# Altium schematic sheet IOT_ESP32-OUTLET.SchDoc
size A2
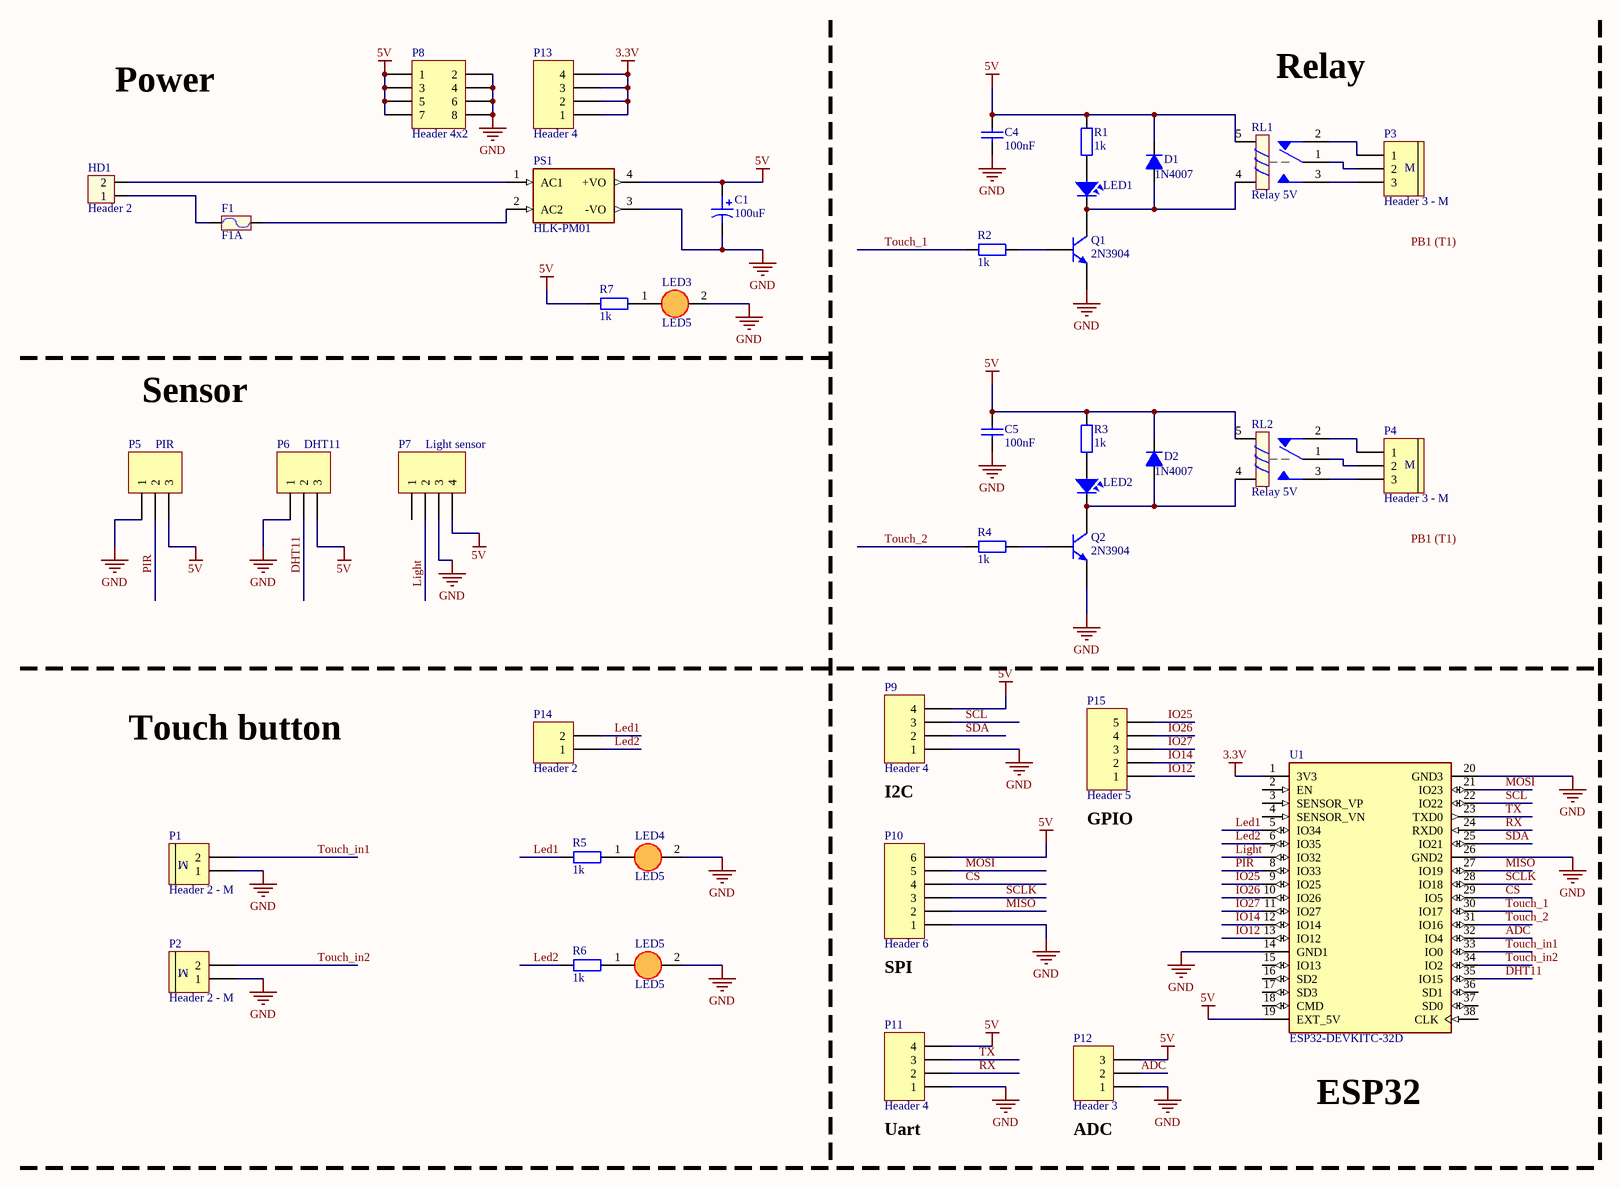
[diagram p0: IOT_ESP32-OUTLET.SchDoc]

## Parts
C1  value 100uF  [RADIAL C]  (hidden comment: Cap Pol)
C4  value 100nF  [Cap Non-Pol 3mm]  (hidden comment: Cap Non-pol)
C5  value 100nF  [Cap Non-Pol 3mm]  (hidden comment: Cap Non-pol)
D1  1N4007  [D1A]
D2  1N4007  [D1A]
F1  F1A  [Fuse]
HD1  Header 2  [HED2]
LED1  LED  [LED-3]  (value not drawn)
LED2  LED  [LED-3]  (value not drawn)
LED3  LED5  [LED5MM]
LED4  LED5  [LED5MM]
LED5  LED5  [LED5MM]
P1  Header 2 - M  [Medium - Header 2]
P2  Header 2 - M  [Medium - Header 2]
P3  Header 3 - M  [Medium - Header 3]
P4  Header 3 - M  [Medium - Header 3]
P5  PIR  [Header 3]
P6  DHT11  [Header 3]
P7  Light sensor  [HDR1X4]
P8  Header 4x2  [Header 4x2]
P9  Header 4  [Header 4]
P10  Header 6  [Header 6]
P11  Header 4  [Header 4]
P12  Header 3  [Header 3]
P13  Header 4  [HDR1X4]
P14  Header 2  [HDR1X2]
P15  Header 5  [HDR1X5]
PS1  HLK-PM01  [CONV_HLK-PM01]
Q1  2N3904  [TO-92A]
Q2  2N3904  [TO-92A]
R1  1k  [R1/4W]
R2  1k  [R1/4W]
R3  1k  [R1/4W]
R4  1k  [R1/4W]
R5  1k  [R1/4W]
R6  1k  [R1/4W]
R7  1k  [R1/4W]
RL1  Relay 5V  [RL_SPDT_10A]
RL2  Relay 5V  [RL_SPDT_10A]
U1  ESP32-DEVKITC-32D  [MODULE_ESP32-DEVKITC-32D]

## Nets
3.3V: P13.1 P13.2 P13.3 P13.4 U1.1(3V3)
5V: C1.1 C4.2 C5.2 D1.2(K) D2.2(K) P5.3 P6.3 P7.4 P8.1 P8.3 P8.5 P8.7 P9.4 P10.6 P11.4 P12.3 PS1.4(+VO) R1.2 R3.2 R7.1 RL1.5 RL2.5 U1.19(EXT_5V)
GND: C1.2 C4.1 C5.1 LED3.2(K) LED4.2(K) LED5.2(K) P1.1 P2.1 P5.1 P6.1 P7.3 P8.2 P8.4 P8.6 P8.8 P9.1 P10.1 P11.1 P12.1 PS1.3(-VO) Q1.1(E) Q2.1(E) U1.14(GND1) U1.20(GND3) U1.26(GND2)
ADC: P12.2 U1.32(IO4)
CS: P10.4 U1.29(IO5)
DHT11: P6.2 U1.35(IO15)
IO12: P15.1 U1.13(IO12)
IO14: P15.2 U1.12(IO14)
IO25: P15.5 U1.9(IO25)
IO26: P15.4 U1.10(IO26)
IO27: P15.3 U1.11(IO27)
Led1: P14.2 R5.1 U1.5(IO34)
Led2: P14.1 R6.1 U1.6(IO35)
Light: P7.2 U1.7(IO32)
MISO: P10.2 U1.27(IO19)
MOSI: P10.5 U1.21(IO23)
PIR: P5.2 U1.8(IO33)
RX: P11.2 U1.24(RXD0)
SCL: P9.3 U1.22(IO22)
SCLK: P10.3 U1.28(IO18)
SDA: P9.2 U1.25(IO21)
Touch_1: R2.2 U1.30(IO17)
Touch_2: R4.2 U1.31(IO16)
Touch_in1: P1.2 U1.33(IO0)
Touch_in2: P2.2 U1.34(IO2)
TX: P11.3 U1.23(TXD0)
NetD1_1: D1.1(A) LED1.2 Q1.3(C) RL1.4
NetD2_1: D2.1(A) LED2.2 Q2.3(C) RL2.4
NetF1_1: F1.1 HD1.1
NetF1_2: F1.2 PS1.2(AC2)
NetHD1_2: HD1.2 PS1.1(AC1)
NetLED1_1: LED1.1 R1.1
NetLED2_1: LED2.1 R3.1
NetLED3_1: LED3.1(A) R7.2
NetLED4_1: LED4.1(A) R5.2
NetLED5_1: LED5.1(A) R6.2
NetP3_1: P3.1 RL1.2
NetP3_2: P3.2 RL1.1
NetP3_3: P3.3 RL1.3
NetP4_1: P4.1 RL2.2
NetP4_2: P4.2 RL2.1
NetP4_3: P4.3 RL2.3
NetQ1_2: Q1.2(B) R2.1
NetQ2_2: Q2.2(B) R4.1

Not connected (* = marked no-connect by the designer): P7 1; U1 2(EN) 3(SENSOR_VP) 4(SENSOR_VN) 15(IO13) 16(SD2) 17(SD3) 18(CMD) 36(SD1) 37(SD0) 38(CLK)

## Notes on the sheet
- Power
- Relay
- Sensor
- Touch button
- I2C
- (near P15) GPIO
- (near P10) SPI
- ESP32
- (near P11) Uart
- (near P12) ADC
- Labels drawn without touching a wire or pin: PB1 (T1)
- (in symbol Header 2 - M) M
- (in symbol Header 3 - M) M

## Library data of the parts
C1 = Cap Pol: Polarized Capacitor; Published: 8-Jun-2000; LatestRevisionDate: 17-Jul-2002; LatestRevisionNote: Re-released for DXP Platform.; PackageReference: POLAR0.8; Publisher: Altium Limited
C4 C5 = Cap Non-pol: Non-polarized Capacitor; Published: 8-Jun-2000; LatestRevisionDate: 17-Jul-2002; LatestRevisionNote: Re-released for DXP Platform.; PackageReference: RAD-0.3; Publisher: Altium Limited
D1 D2 = D1A: Diode 1A; Value: 1N4007
F1 = Fuse: Designed by: VanDungEvn; Value: Fuse
HD1 = Hed2: Header 2 (Green); Value: Header 2
LED1 LED2 = LED: LED Single colour Green and Red; Value: LED 3 ly Single Colour
LED3-LED5 = LED 5mm
P1 P2 = Header 2 - M: Header, 2-Pin, Medium; LatestRevisionDate: 17-Jul-2002; LatestRevisionNote: Re-released for DXP Platform.; Publisher: Altium Limited
P3 P4 = Header 3 - M: Header, 3-Pin, Medium; LatestRevisionDate: 17-Jul-2002; LatestRevisionNote: Re-released for DXP Platform.; Publisher: Altium Limited
P5 P6 P12 = Header 3: Header, 3-Pin; LatestRevisionDate: 17-Jul-2002; LatestRevisionNote: Re-released for DXP Platform.; Publisher: Altium Limited
P7 P9 P11 P13 = Header 4: Header, 4-Pin; LatestRevisionDate: 17-Jul-2002; LatestRevisionNote: Re-released for DXP Platform.; Publisher: Altium Limited
P8 = Header 4x2: Header, 8-Pin, 2-Row; LatestRevisionDate: 17-Jul-2002; LatestRevisionNote: Re-released for DXP Platform.; Publisher: Altium Limited
P10 = Header 6: Header, 6-Pin; LatestRevisionDate: 17-Jul-2002; LatestRevisionNote: Re-released for DXP Platform.; Publisher: Altium Limited
P14 = Header 2: Header, 2-Pin; LatestRevisionDate: 17-Jul-2002; LatestRevisionNote: Re-released for DXP Platform.; Publisher: Altium Limited
P15 = Header 5: Header, 5-Pin; LatestRevisionDate: 17-Jul-2002; LatestRevisionNote: Re-released for DXP Platform.; Publisher: Altium Limited
PS1 = HLK-PM01: The HLK-PM01 is a small size low cost AC to DC converter which can take in 110V/220V AC at 50/60 Hz and give 5V 3W output. The module is can be used in designs which run on 5V and needs to be powered form the AC mains.; MF: Hi-link; SnapEDA_Link: https://www.snapeda.com/parts/hlk-pm01/Hi-link/view-part/?ref=snap; Package: None; Value: *; MP: hlk-pm01; Check_prices: https://www.snapeda.com/parts/hlk-pm01/Hi-link/view-part/?ref=eda
Q1 Q2 = 2N3904: NPN General Purpose Amplifier; Published: 8-Jun-2000; LatestRevisionDate: 15-Jan-2003; LatestRevisionNote: PCB Footprint 'BCY-W3/D4.7' replaced; DatasheetVersion: 1997; PackageVersion: Sep-1998; PackageReference: TO-92A; Publisher: Altium Limited; PackageDescription: TO, Flat Index; 3 In-Line, Axial Leads; Body Dia. 4.5mm; Leads 0.51 x 0.48 mm (max); ComponentLink1Description: Manufacturer Link; ComponentLink1URL: http://www.fairchildsemi.com/; ComponentLink2Description: Datasheet; ComponentLink2URL: http://www.fairchildsemi.com/ds/2N%2F2N3904.pdf
R1-R7 = R1/4W: Resistor 1/4W; Value: R1/4W - 1K
RL1 RL2 = Relay 1: Relay SPDT,10A - 12VDC 5 Pin; Value: Relay SPDT, 10A, 12V
U1 = ESP32-DEVKITC-32D: Eval Board For Esp-Wroom-32; Package: None; Availability: Unavailable; Value: *; MP: ESP32-DEVKITC-32D; Price: None